# EAGLE schematic untitled (EAGLE 6.1)
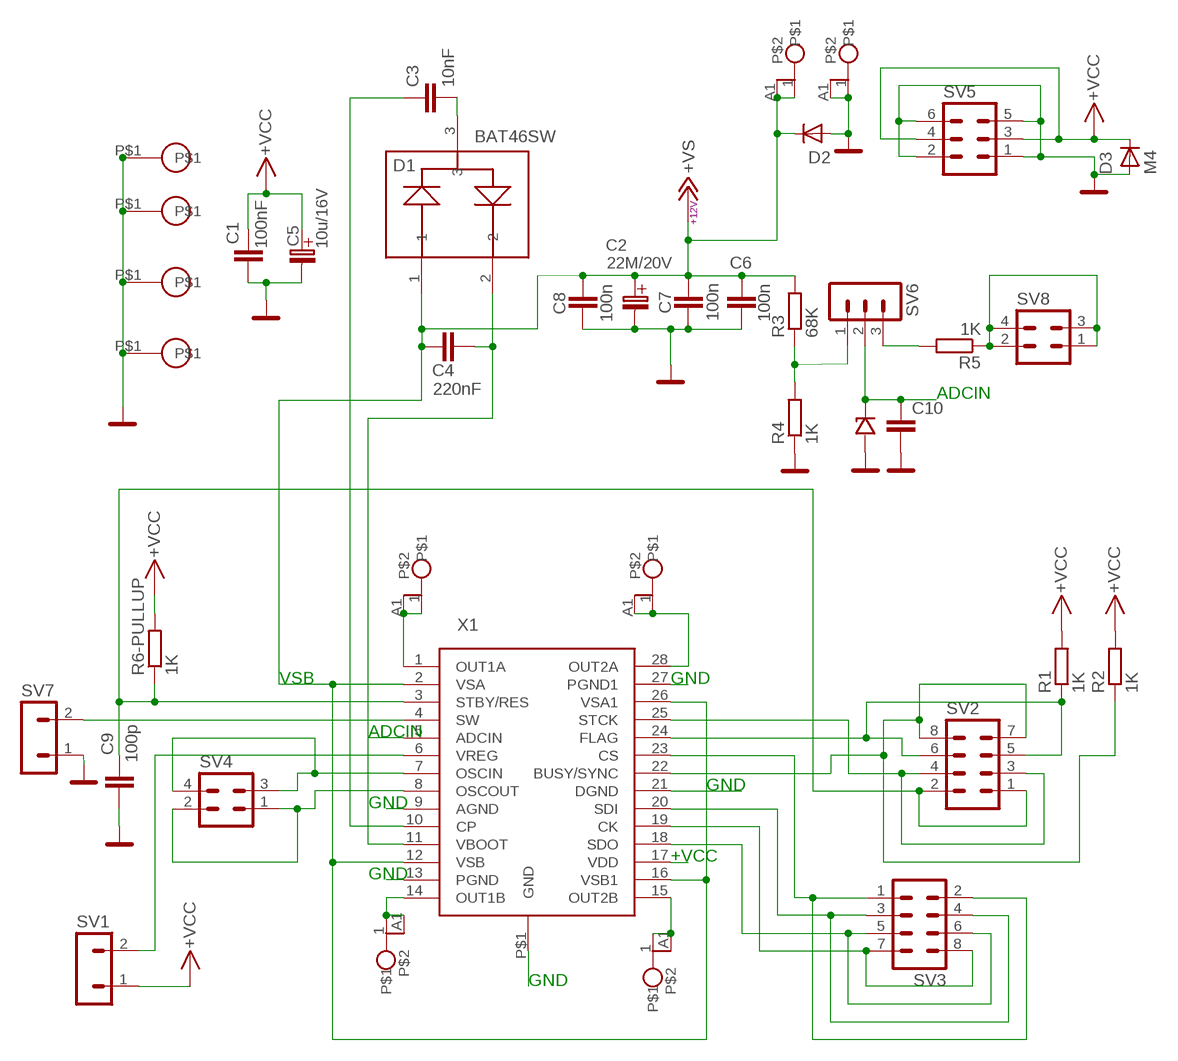
[diagram p0: schematic, sheet 1]

## Parts
C1  100nF  C-EUC0805  [C0805]
C2  22M/20V  [D]
C3  10nF  C-EUC0805  [C0805]
C4  220nF  C-EUC0805  [C0805]
C5  10u/16V  1M/35V  [B]
C6  100n  C-EUC0805  [C0805]
C7  100n  C-EUC0805  [C0805]
C8  100n  C-EUC0805  [C0805]
C9  100p  C-EUC0805  [C0805]
C10  C-EUC0805  [C0805]
CON1  WAGO256  [WAGO256]
CON2  WAGO256  [WAGO256]
CON3  WAGO256  [WAGO256]
CON4  WAGO256  [WAGO256]
CON5  WAGO256  [WAGO256]
CON6  WAGO256  [WAGO256]
D1  BAT46SW  BAR43S  [SOT23]
D2  D-OB.  [SMB]
D3  M4  D-OB.SMA  [SMA]
D4  D-ZENEROVA  [MINIMELF]
R1  1K  R-EU_R0805  [R0805]
R2  1K  R-EU_R0805  [R0805]
R3  68K  R-EU_R0805  [R0805]
R4  1K  R-EU_R0805  [R0805]
R5  1K  R-EU_R0805  [R0805]
R6-PULLUP  1K  R-EU_R0805  [R0805]
SV1  MA02-1  [MA02-1]
SV2  MA04-2  [MA04-2]
SV3  MA04-2  [MA04-2]
SV4  MA02-2  [MA02-2]
SV5  MA03-2  [MA03-2]
SV6  MA03-1  [MA03-1]
SV7  MA02-1  [MA02-1]
SV8  MA02-2  [MA02-2]
X1  L6470  [HTSSOP28]
X3  SROUB3M  [SROUB3M]
X4  SROUB3M  [SROUB3M]
X5  SROUB3M  [SROUB3M]
X6  SROUB3M  [SROUB3M]

## Nets
+12V: C2.+(C_EL+) C4.1 C6.1 C7.1 C8.1 CON6.1 CON6.A1 D1.1 D2.K(C) R3.2 X1.2(VSA) X1.12(VSB) X1.16(VSB1) X1.26(VSA1) ; supply symbol labelled +VS
ADCIN: C10.1 D4.C(K) SV6.2 X1.5(ADCIN)
GND: C1.2 C2.-(C_EL-) C5.-(C_EL-) C6.2 C7.2 C8.2 C9.2 C10.2 CON5.1 CON5.A1 D2.A D3.A D4.A R4.1 SV5.1 SV5.2 SV5.5 SV5.6 SV7.1 X1.9(AGND) X1.13(PGND) X1.21(DGND) X1.27(PGND1) X1.P$1(GND) X3.P$1 X4.P$1 X5.P$1 X6.P$1
N$1: R1.1 SV2.5 SV2.6 X1.24(FLAG)
N$2: R2.1 SV2.7 SV2.8 X1.22(BUSY/SYNC)
N$3: SV2.3 SV2.4 X1.25(STCK)
N$4: C9.1 R6-PULLUP.1 SV2.1 SV2.2 X1.3(STBY/RES)
N$5: SV3.1 SV3.2 X1.23(CS)
N$6: SV3.3 SV3.4 X1.20(SDI)
N$7: SV3.5 SV3.6 X1.18(SDO)
N$8: SV1.2 X1.6(VREG)
N$9: SV7.2 X1.4(SW)
N$10: SV4.3 SV4.4 X1.7(OSCIN)
N$11: CON4.1 CON4.A1 X1.28(OUT2A)
N$12: CON3.1 CON3.A1 X1.1(OUT1A)
N$13: CON1.1 CON1.A1 X1.14(OUT1B)
N$14: CON2.1 CON2.A1 X1.15(OUT2B)
N$15: SV4.1 SV4.2 X1.8(OSCOUT)
N$16: SV3.7 SV3.8 X1.19(CK)
N$17: R3.1 R4.2 SV6.1
N$18: R5.2 SV6.3
N$19: C4.2 D1.2 X1.11(VBOOT)
N$20: C3.2 D1.3
N$21: C3.1 X1.10(CP)
N$22: R5.1 SV8.1 SV8.2 SV8.3 SV8.4
VCC: C1.1 C5.+(C_EL+) D3.K(C) R1.2 R2.2 R6-PULLUP.2 SV1.1 SV5.3 SV5.4 X1.17(VDD) ; supply symbol labelled +VCC

## Notes on the sheet
- ADCIN
- VSB | GND
- ADCIN
- GND
- GND
- +VCC
- GND
- GND

## Library data of the parts
C1 C3 C4 C6-C10 = rcl:C-EU: CAPACITOR, European symbol
C2 = PaJa_C-tantal_SMD:22M/20V
C5 = PaJa_C-tantal_SMD:1M/35V
CON1-CON6 = PaJa_22:WAGO256: Konektor WAGO - RM 5,08mm - s packou
D1 = moje_diody:BAR43S
D2 = moje:D-OB.: smb
D3 = moje:D-OB.SMA: SMA
D4 = moje_diody:D-ZENEROVA
R1-R5 R6-PULLUP = rcl:R-EU_: RESISTOR, European symbol
SV1 SV7 = moje_hrebinky:MA02-1
SV2 SV3 = moje_hrebinky:MA04-2: PIN HEADER; OC_FARNELL: unknown; OC_NEWARK: unknown
SV4 SV8 = moje_hrebinky:MA02-2
SV5 = moje_hrebinky:MA03-2: PIN HEADER; OC_FARNELL: unknown; OC_NEWARK: unknown
SV6 = moje_hrebinky:MA03-1: PIN HEADER; OC_FARNELL: unknown; OC_NEWARK: unknown
X1 = moje_io:L6470
X3-X6 = moje:SROUB3M